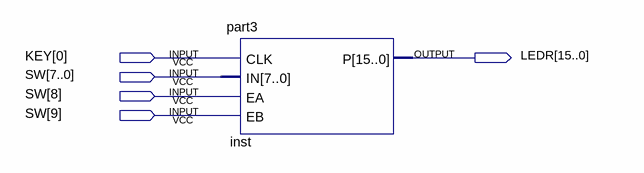
[diagram p0: schematic sheet]
// Quartus schematic part4_sch.bdf as structural Verilog: 1 symbols, 5 pins
module part4_sch (
  input  [0:0] KEY,
  input  [9:0] SW,
  output [15:0] LEDR
);

  part3 inst (.CLK(KEY[0]), .IN(SW[7:0]), .EA(SW[8]), .EB(SW[9]), .P(LEDR));
endmodule
